# EasyEDA Pro project STM32主控板.eprj

# Schematic Schematic1
Board Name: Board1; Create Date: 2026-03-11; Page Name: P1; Project Name: STM32主控板; Schematic Name: Schematic1; Update Date: 2026-03-11; Company: 嘉立创EDA; Page Size: A4; Version: V1.0
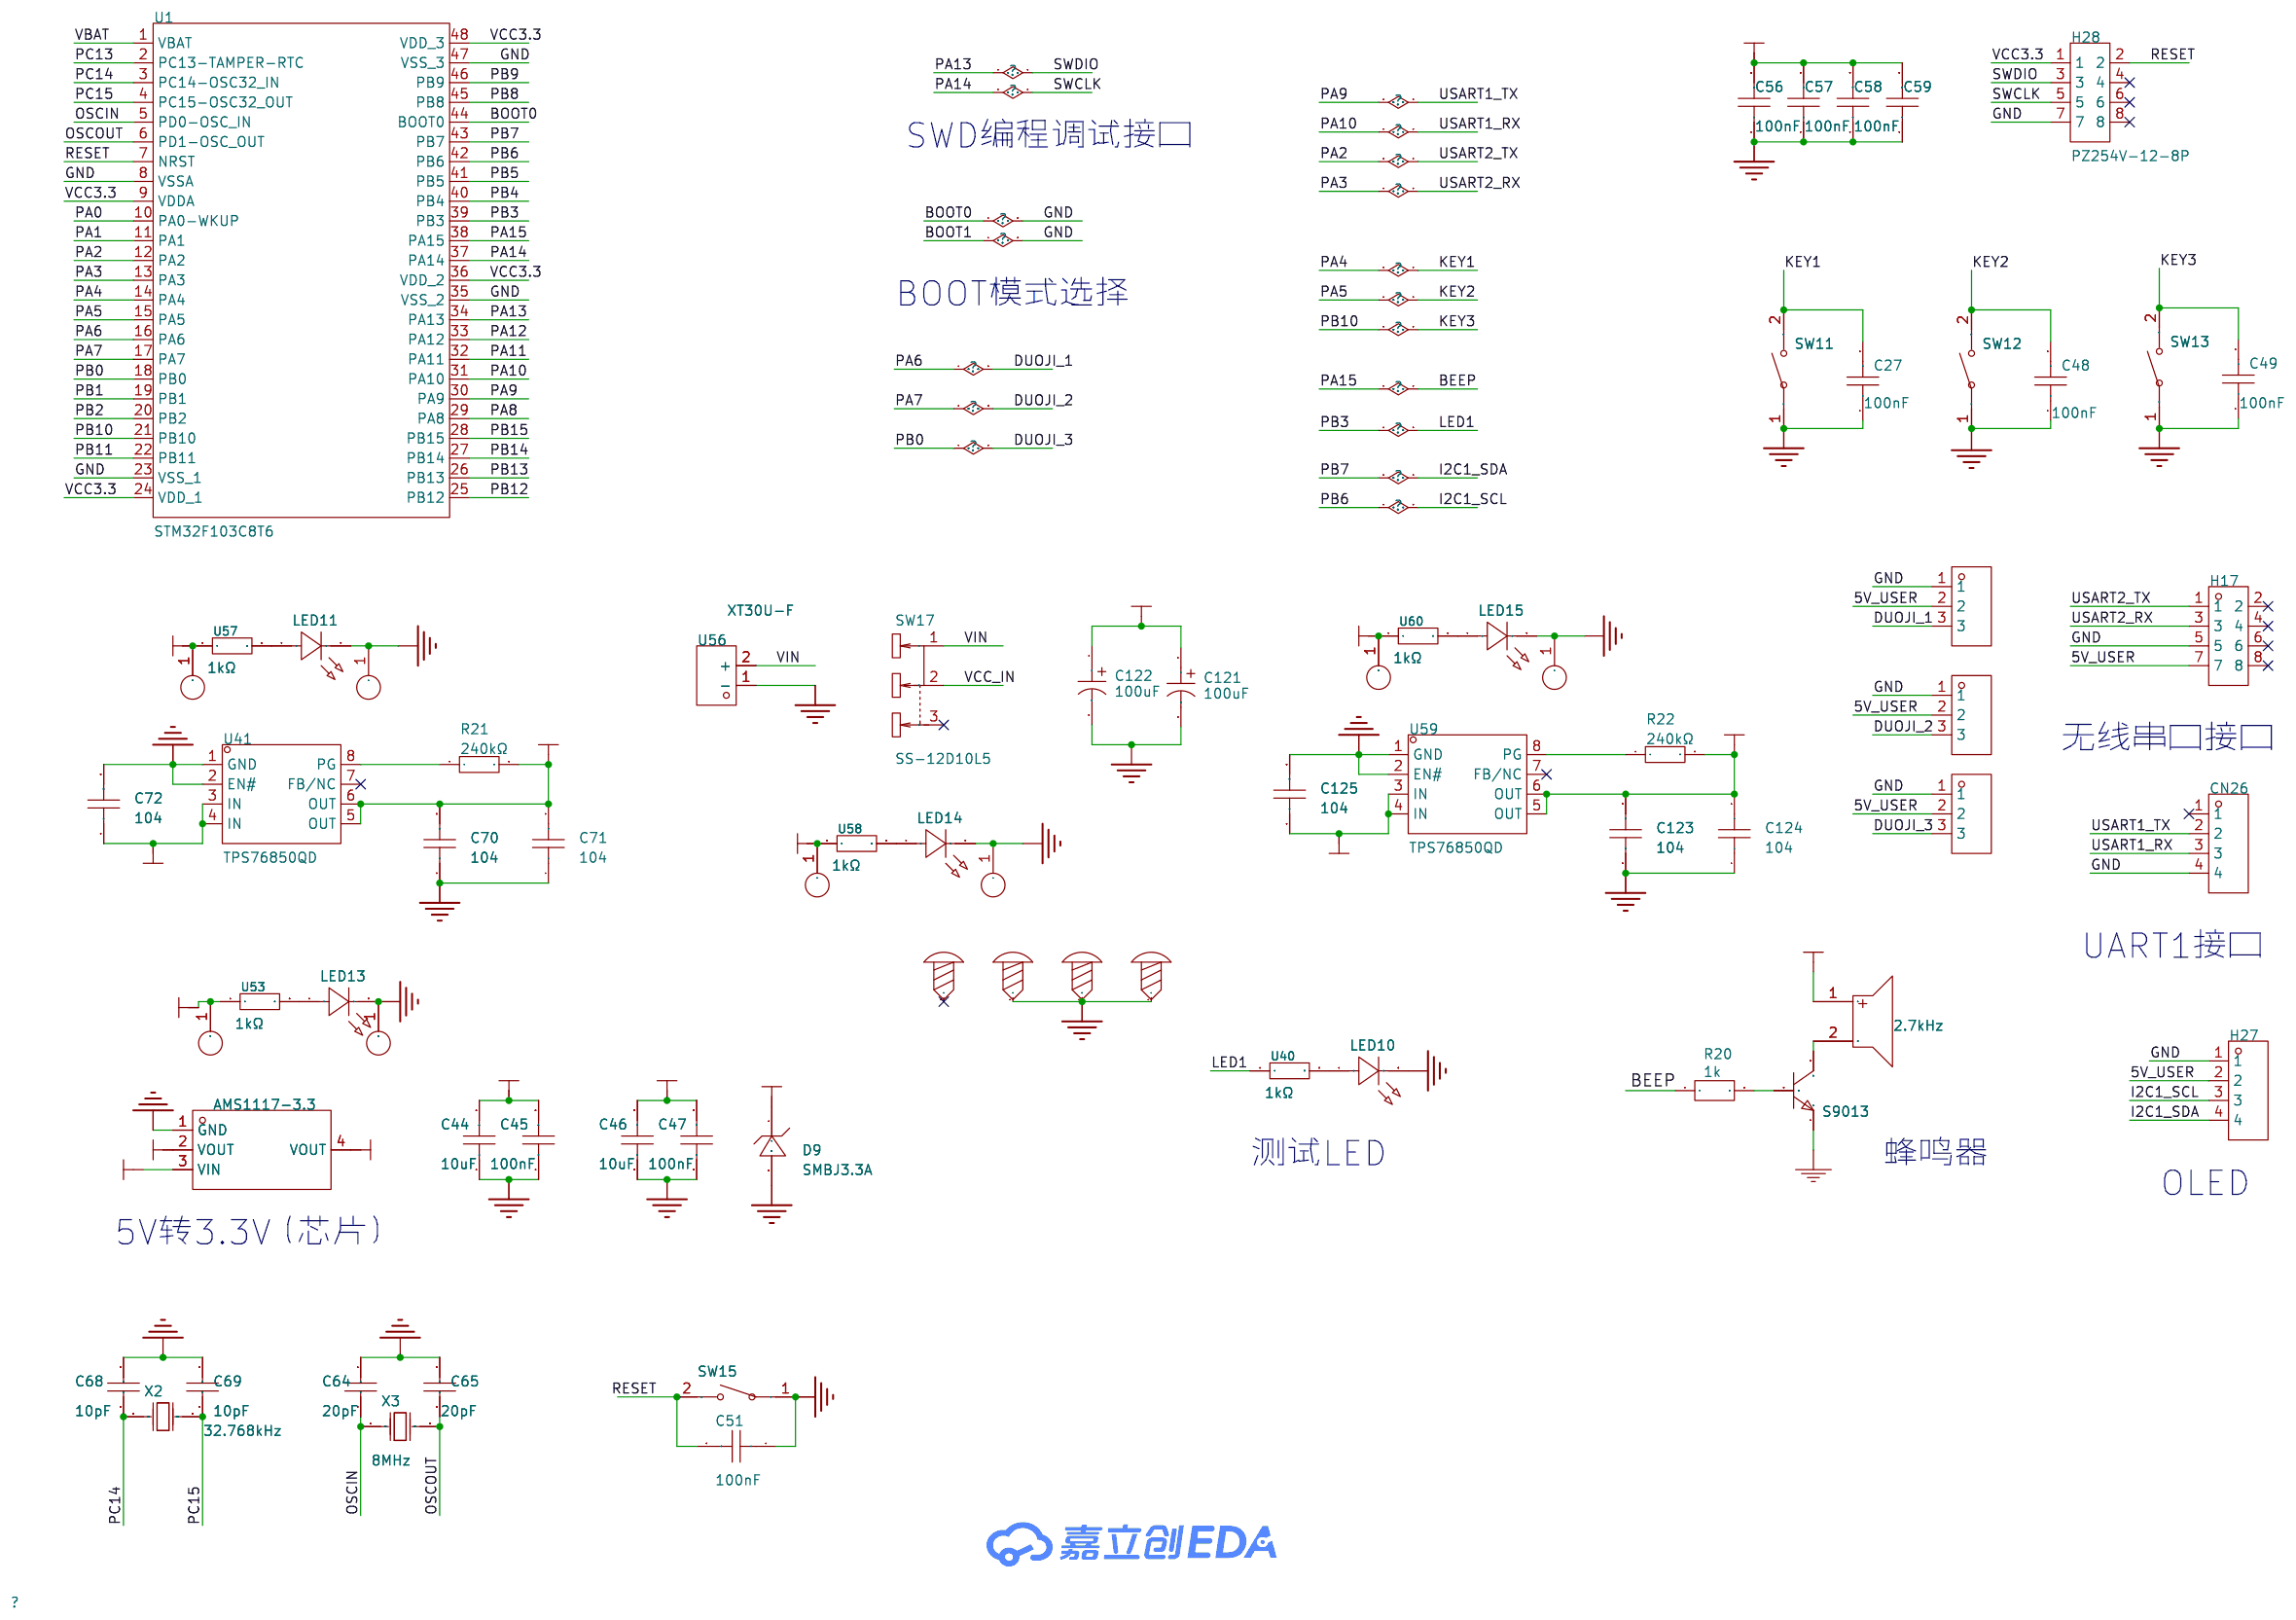
[diagram p0: schematic sheet]

## Parts
BUZZER1  2.7kHz  [BUZ-TH_BD9.0-P4.00-D0.6-FD]
C27  100nF  [C0603]
C44  10uF  [C0603]
C45  100nF  [C0603]
C46  10uF  [C0603]
C47  100nF  [C0603]
C48  100nF  [C0603]
C49  100nF  [C0603]
C51  100nF  [C0603]
C56  100nF  [C0603]
C57  100nF  [C0603]
C58  100nF  [C0603]
C59  100nF  [C0603]
C64  20pF  [C0603]
C65  20pF  [C0603]
C68  10pF  [C0603]
C69  10pF  [C0603]
C70  104  [C0603]
C71  104  [C0603]
C72  104  [C0603]
C121  100uF  [CAP-SMD_BD6.3-L6.6-W6.6-LS7.6-FD-1]
C122  100uF  [CAP-SMD_BD6.3-L6.6-W6.6-LS7.6-FD-1]
C123  104  [C0603]
C124  104  [C0603]
C125  104  [C0603]
CN15  5012  [TESTPOINT-TH_BD2.0_C9900010656]  (no BOM)
CN18  5012  [TESTPOINT-TH_BD2.0_C9900010656]  (no BOM)
CN26  ZX-XH2.54-4PZZ  [CONN-TH_4P-P2.50_4PIN]
CN28  5012  [TESTPOINT-TH_BD2.0_C9900010656]  (no BOM)
CN29  5012  [TESTPOINT-TH_BD2.0_C9900010656]  (no BOM)
CN30  5012  [TESTPOINT-TH_BD2.0_C9900010656]  (no BOM)
CN31  5012  [TESTPOINT-TH_BD2.0_C9900010656]  (no BOM)
CN49  ZX-XH2.54-3PZZ  [CONN-TH_3P-P2.54_2501S-3P]
CN50  ZX-XH2.54-3PZZ  [CONN-TH_3P-P2.54_2501S-3P]
CN52  ZX-XH2.54-3PZZ  [CONN-TH_3P-P2.54_2501S-3P]
CN53  5012  [TESTPOINT-TH_BD2.0_C9900010656]  (no BOM)
CN54  5012  [TESTPOINT-TH_BD2.0_C9900010656]  (no BOM)
D9  SMBJ3.3A  [SMB_L4.6-W3.6-LS5.3-RD]
H17  PM254V-12-08-H85  [HDR-TH_8P-P2.54-V-F-R2-C4-S2.54]
H27  PZ254V-11-04P  [HDR-TH_4P-P2.54-V-M]
H28  PZ254V-12-8P  [HDR-TH_8P-P2.54-V-M-R2-C4-S2.54]
LED10  XL-3216SURC  [LED1206-R-RD_RED]
LED11  XL-3216SURC  [LED1206-R-RD_RED]
LED13  XL-3216SURC  [LED1206-R-RD_RED]
LED14  XL-3216SURC  [LED1206-R-RD_RED]
LED15  XL-3216SURC  [LED1206-R-RD_RED]
Q1  S9013  [SOT-23-3_L2.9-W1.3-P1.90-LS2.4-TR]
R20  1k  [R0603]
R21  240kΩ  [R0603]
R22  240kΩ  [R0603]
SCREW1  -  [M3螺丝]
SCREW2  -  [M3螺丝]
SCREW3  -  [M3螺丝]
SCREW4  -  [M3螺丝]
SW11  K2-1107ST-A4DW-06  [KEY-SMD_L6.2-W3.6-LS8.0]
SW12  K2-1107ST-A4DW-06  [KEY-SMD_L6.2-W3.6-LS8.0]
SW13  K2-1107ST-A4DW-06  [KEY-SMD_L6.2-W3.6-LS8.0]
SW15  K2-1107ST-A4DW-06  [KEY-SMD_L6.2-W3.6-LS8.0]
SW17  SS-12D10L5  [SW-TH_SS-12D10L5]
U1  STM32F103C8T6  [LQFP-48_L7.0-W7.0-P0.50-LS9.0-BL]
U38  AMS1117-3.3  [SOT-223-3_L6.5-W3.4-P2.30-LS7.0-BR]
U40  1kΩ  [R0603]
U41  TPS76850QD  [SOIC-8_L4.9-W3.9-P1.27-LS6.0-BL]
U53  1kΩ  [R0603]
U56  XT30U-F  [CONN-TH_XT30U-F]
U57  1kΩ  [R0603]
U58  1kΩ  [R0603]
U59  TPS76850QD  [SOIC-8_L4.9-W3.9-P1.27-LS6.0-BL]
U60  1kΩ  [R0603]
X2  32.768kHz  [CRYSTAL-SMD_L3.2-W1.5-1]
X3  8MHz  [CRYSTAL-SMD_L5.0-W3.2]

## Library data of the parts
BUZZER1 = QMB-09B-03: 驱动方式:无源(外部驱动);构造类型:电磁式;频率:2.7kHz;声压(SPL):85dB@3V,10cm;; LCSC Part Name: 无源蜂鸣器QMB-09B-03; Supplier Part: C96256; Manufacturer: 华能; Supplier Footprint: 插件,D=9mm; JLCPCB Part Class: 扩展库; Datasheet: https://atta.szlcsc.com/upload/public/pdf/source/20210401/C96256_958B17753B5AD7CBFBCFFC7C095B4484.pdf; Supplier: LCSC; Oscillator Circuit: 无源(外部驱动); Technology Type: 电磁式; Operating Voltage: 2V~5V; Sound Pressure Level (SPL): 85dB@3V,10cm; Diameter (φD): 9mm; Height: 5.7mm
C27 C45 C47-C49 C51 C56-C59 = CC0603KRX7R9BB104: 容值:100nF;精度:±10%;额定电压:50V;材质(温度系数):X7R;; LCSC Part Name: 100nF ±10% 50V; Supplier Part: C14663; Manufacturer: YAGEO(国巨); Supplier Footprint: 0603; JLCPCB Part Class: Basic Part; Datasheet: https://atta.szlcsc.com/upload/public/pdf/source/20180910/C282072_33301C7F631E79921B82A8DAC6BCC5B3.pdf; Supplier: LCSC; Tolerance: ±10%; Voltage Rated: 50V; Temperature Coefficient: X7R
C44 C46 = CL10A106MA8NRNC: 容值:10uF;精度:±20%;额定电压:25V;材质(温度系数):X5R;; LCSC Part Name: 10uF ±20% 25V; Supplier Part: C96446; Manufacturer: SAMSUNG(三星); Supplier Footprint: 0603; JLCPCB Part Class: 基础库; Datasheet: https://atta.szlcsc.com/upload/public/pdf/source/20160218/1457707763339.pdf; Supplier: LCSC; Tolerance: ±20%; Voltage Rated: 25V; Temperature Coefficient: X5R
C64 C65 = CL10C200JB8NNNC: 容值:20pF;精度:±5%;额定电压:50V;材质(温度系数):C0G;; LCSC Part Name: 20pF ±5% 50V; Supplier Part: C1648; Manufacturer: SAMSUNG(三星); Supplier Footprint: 0603; JLCPCB Part Class: 基础库; Datasheet: https://atta.szlcsc.com/upload/public/pdf/source/20160218/1457707763339.pdf; Supplier: LCSC; Tolerance: ±5%; Voltage Rated: 50V; Temperature Coefficient: C0G
C68 C69 = CL10C100JB8NNNC: 容值:10pF;精度:±5%;额定电压:50V;材质(温度系数):C0G;; LCSC Part Name: 10pF ±5% 50V; Supplier Part: C1634; Manufacturer: SAMSUNG(三星); Supplier Footprint: 0603; JLCPCB Part Class: 基础库; Datasheet: https://atta.szlcsc.com/upload/public/pdf/source/20160218/1457707763339.pdf; Supplier: LCSC; Tolerance: ±5%; Voltage Rated: 50V; Temperature Coefficient: C0G
C70-C72 C123-C125 = CGA0603X7R104K500JT: LCSC Part Name: 100nF ±10% 50V; Supplier Part: C6119867; Manufacturer: HRE(芯声); Supplier Footprint: 0603; JLCPCB Part Class: 扩展库; Datasheet: https://item.szlcsc.com/datasheet/CGA0603X7R104K500JT/7062573.html; Supplier: LCSC; Tolerance: ±10%; Voltage Rating: 50V; Temperature Coefficient: X7R
C121 C122 = RVE100UF35V67RV0072: 容值:100uF;精度:±20%;额定电压:35V;纹波电流:230mA@120Hz;等效串联电阻:600mΩ@100kHz;; LCSC Part Name: 100uF ±20% 35V; Supplier Part: C2836437; Manufacturer: KNSCHA(科尼盛); Supplier Footprint: SMD,D6.3xL7.7mm; JLCPCB Part Class: Extended Part; Datasheet: https://atta.szlcsc.com/upload/public/pdf/source/20220719/B52EB46F8A1558448ED03D8B4CB3C24F.pdf; Supplier: LCSC; Tolerance: ±20%; Rated Voltage: 35V; Ripple Current: 230mA@120Hz; Equivalent Series Resistance(ESR): 600mΩ@100kHz; φD: 6.3mm; L: 7.7mm; Lifetime @ Temp: 2000hrs@105℃; Operating Temperature: -55℃~+105℃
CN15 CN18 CN28-CN31 CN53 CN54 = 5012: LCSC Part Name: 测试点; Supplier Part: C2906766; Manufacturer: Keystone; JLCPCB Part Class: ExtendedPart; Datasheet: https://atta.szlcsc.com/upload/public/pdf/source/20211102/12102DF701EA335825673F0350517149.pdf; Supplier: LCSC; Check: true
CN26 = ZX-XH2.54-4PZZ: 插针结构:1x4P;间距:2.54mm;安装方式:直插;参考系列:XH;总PIN数:4P;排数:1;每排PIN数:4;行距:-;额定电流:3A;触头材质:黄铜;触头镀层:锡;工作温度范围:-25℃~+85℃;; Supplier Part: C7429634; Manufacturer: Megastar(兆星); Supplier Footprint: 插件,P=2.54mm; JLCPCB Part Class: 扩展库; Datasheet: https://atta.szlcsc.com/upload/public/pdf/source/20230619/B529A2163E0159A644AB3383D208FB03.pdf; Supplier: LCSC; Pins Structure: 1x4P; Pitch: 2.54mm; Mounting Style: 直插; Reference Series: XH; Number of Pins: 4P; Number of Rows: 1; Number of PINs Per Row: 4; Current Rating (Max): 3A; Contact Material: 黄铜; Contact Plating: 锡; Operating Temperature Range: -25℃~+85℃
CN49 CN50 CN52 = ZX-XH2.54-3PZZ: LCSC Part Name: 1x3P 间距:2.5mm 直插 系列:XH; Supplier Part: C7429633; Manufacturer: Megastar(兆星); Supplier Footprint: 插件,P=2.5mm; JLCPCB Part Class: 扩展库; Datasheet: https://item.szlcsc.com/datasheet/ZX-XH2.54-3PZZ/8427550.html; Supplier: LCSC; Pins Structure: 1x3P; Pitch: 2.5mm; Mounting Type: 直插; Reference Series: XH; Number of Pins: 3P; Number of Rows: 1; Number of PINs Per Row: 3; Current Rating: 3A; Contact Material: 黄铜; Contact Plating: 锡; Operating Temperature: -25℃~+85℃; Voltage Rating: 250V; Plastic Material: PA66; Flame Retardant Rating: UL94V-0; Color: 白色; Z-Height of the Board: 7mm; X-Length of Bottom Edge on Board (Spacing Line): 10mm; Y-Width of Bottom Edge on Board: 5.9mm; Mounting Style: 直插; Current Rating (Max): 3A; Operating Temperature Range: -25℃~+85℃
D9 = SMBJ3.3A_C362089: 反向截止电压(Vrwm):3.3V;最大钳位电压:7.3V;峰值脉冲功率(Ppp)@10/1000us:600W;击穿电压:4.1V;; LCSC Part Name: 单向TVS 3.3V截止 600W峰值脉冲功率; Supplier Part: C362089; Manufacturer: JKSEMI(金开盛); Supplier Footprint: SMB(DO-214AA); JLCPCB Part Class: 扩展库; Datasheet: https://atta.szlcsc.com/upload/public/pdf/source/20200731/C362089_3B984BF84356FE4A5051ADB3F5B1E766.pdf; Supplier: LCSC; Reverse Stand-Off Voltage (Vrwm): 3.3V; Maximum Clamping Voltage: 7.3V; Peak Pulse Power Dissipation (Ppp)@10/1000us: 600W; Breakdown Voltage: 4.1V; Type: TVS
H17 = PM254V-12-08-H85: 插孔结构:2x4P;间距:2.54mm;行距:2.54mm;圆孔/方孔:方孔;安装类型:直插;排数:双排;总孔位数:8P;额定电流:3A;额定电压:250V;插孔方向:顶部;塑高:8.5mm;工作温度范围:-40℃~+105℃;; LCSC Part Name: 间距:2.54mm 2x4P 直插; Supplier Part: C2834799; Manufacturer: XFCN(兴飞); Supplier Footprint: 插件,P=2.54mm; JLCPCB Part Class: 扩展库; Datasheet: https://atta.szlcsc.com/upload/public/pdf/source/20200309/C492399_8C441E2934FBB604A89B37A68AA45ECF.pdf; Supplier: LCSC; Holes Structure: 2x4P; Pitch: 2.54mm; Row Spacing: 2.54mm; Circular Hole / Square Hole: 方孔; Mounting Type: 直插; Number of Rows: 双排; Number of Holes: 8P; Current Rating (Max): 3A; Voltage Rating (Max): 250V; Holes Direction: 顶部; Insulation Height: 8.5mm; Operating Temperature Range: -40℃~+105℃
H27 = PZ254V-11-04P: 插针结构:1x4P;间距:2.54mm;行距:-;圆针/方针:方针;安装类型:直插;排数:单排;总PIN位数:4P;额定电流:3A;额定电压:250V;配合针长度:6mm;塑高:2.5mm;端接针长度:3mm;触头材质:-;工作温度范围:-40℃~+105℃;颜色:黑色;; LCSC Part Name: 间距:2.54mm 1x4P 直插 方针; Supplier Part: C2691448; Manufacturer: XFCN(兴飞); Supplier Footprint: 插件,P=2.54mm; JLCPCB Part Class: 扩展库; Datasheet: https://atta.szlcsc.com/upload/public/pdf/source/20200309/C492403_F9F19131791D08044AD4F84F8E751A34.pdf; Supplier: LCSC; Pin Structure: 1x4P; Pitch: 2.54mm; Circluar Pins/Square Pins: 方针; Mounting Type: 直插; Number of Rows: 单排; Number of Pins: 4P; Current Rating (Max): 3A; Voltage Rating (Max): 250V; Length of Mating Pin: 6mm; Insulation Height: 2.5mm; Length of End Connection Pin: 3mm; Operating Temperature Range: -40℃~+105℃; Color: 黑色
H28 = PZ254V-12-8P: LCSC Part Name: 2x4P 间距:2.54mm 方针 直插; Supplier Part: C492421; Manufacturer: XFCN(兴飞); Supplier Footprint: 插件,P=2.54mm; JLCPCB Part Class: 扩展库; Datasheet: https://item.szlcsc.com/datasheet/PZ254V-12-8P/502977.html; Supplier: LCSC; Pin Structure: 2x4P; Pitch: 2.54mm; Row Spacing: 2.54mm; Circluar Pins/Square Pins: 方针; Mounting Type: 直插; Number of Rows: 双排; Number of Pins: 8P; Length of Mating Pin: 6mm; Insulation Height: 2.5mm; Length of End Connection Pin: 3mm; Contact Material: 黄铜; Operating Temperature: -40℃~+105℃; Color: 黑色
LED10 LED11 LED13-LED15 = XL-3216SURC: 发光颜色:红色;功率:55mW;正向电流:25mA;主波长:617nm~621nm;透镜颜色:无色透明透镜;色温:-;发光角度:120°;载带方式:正贴;工作温度:-30℃~+85℃;; Supplier Part: C965822; Manufacturer: XINGLIGHT(成兴光); Supplier Footprint: 1206; JLCPCB Part Class: 扩展库; Datasheet: https://atta.szlcsc.com/upload/public/pdf/source/20221102/38B682A5E5FDBBFCA7077B6272CE8E6F.pdf; Supplier: LCSC; Emitted Color: 红色; Power Dissipation: 55mW; Forward Current: 25mA; Dominant Wavelength: 617nm~621nm; Peak Wavelength: 623nm; Lens Color: 无色透明透镜; Viewing Angle: 120°; Mounting Sytle: 正贴; Operating Temperature: -30℃~+85℃
Q1 = S9013: link: https://item.szlcsc.com/70837.html; 3DModel: SOT-23-3P_L2.9-W1.3-H1.0-LS2.4-P0.95; Supplier: LCSC; Manufacturer: KEC; Manufacturer Part: 2n3904S-RTK/PS; Supplier Part: C18536; Paste Type: SOT-23
R20 = 1k: link: https://www.mouser.in/datasheet/2/447/PYu_RT_1_to_0_01_RoHS_L_11-1669912.pdf
R21 R22 = 0603WAF1001T5E: LCSC Part Name: 1kΩ ±1% 100mW 厚膜电阻; Supplier Part: C21190; Manufacturer: UNI-ROYAL(厚声); Supplier Footprint: 0603; JLCPCB Part Class: 基础库; Datasheet: https://item.szlcsc.com/datasheet/0603WAF1001T5E/21904.html; Supplier: LCSC; Type: 厚膜电阻; Tolerance: ±1%; Power(Watts): 100mW; Voltage-Supply(Max): 75V; Temperature Coefficient: ±100ppm/℃; Operating Temperature: -55℃~+155℃
SCREW1-SCREW4 = M3螺丝: Supplier Footprint: 插件
SW11-SW13 SW15 = K2-1107ST-A4DW-06: 电路结构:单刀单掷;按钮形状:矩形按钮;作用力:250gf;安装方式:立贴;开关长度:6.1mm;开关宽度:3.6mm;开关高度:2.5mm;触点电流:50mA;额定电压(DC):12V;绝缘电阻:100MΩ;带灯:-;机械寿命:10万次;; LCSC Part Name: 轻触开关 3.6*6.1*2.5; Supplier Part: C118141; Manufacturer: 韩国韩荣; Supplier Footprint: SMD; JLCPCB Part Class: 扩展库; Datasheet: https://atta.szlcsc.com/upload/public/pdf/source/20210810/381712CEF248770C072B585C3485C888.pdf; Supplier: LCSC; Circuit: 单刀单掷; Actuator Style: 矩形按钮; Operating Force: 250gf; Mounting Style: 立贴; Switch Length: 6.1mm; Switch Width: 3.6mm; Switch Height: 2.5mm; Contact Current: 50mA; Voltage Rating (DC): 12V; Insulation Resistance: 100MΩ; Mechanical Life: 10万次; Operating Temperature: -25℃~+85℃
SW17 = SS-12D10L5: 电路结构:单刀双掷;安装方式:直插;开关颜色:黑色;额定电流(DC):3A;额定电压(DC):125V;额定电流(AC):3A;额定电压(AC):125V;机械寿命:1万次;; LCSC Part Name: 柄长5mm 直插双档 滑动开关; Supplier Part: C319012; Manufacturer: XKB Connectivity(中国星坤); Supplier Footprint: 插件; JLCPCB Part Class: 扩展库; Datasheet: https://atta.szlcsc.com/upload/public/pdf/source/20211009/D6412F37AABE6F9459A6EE7FA4DAEADB.pdf; Supplier: LCSC; Circuit: 单刀双掷; Actuator Style: 矩形柱状; Pin Style: PC引脚; Switch Length: 13mm; Switch Width: 6.8mm; Switch Height: 6.4mm; Mounting Style: 直插; Actuator Color: 黑色; Current Rating (DC): 3A; Voltage Rating (DC): 125V; Current Rating (AC): 3A; Voltage Rating (AC): 125V; Mechanical Life: 1万次; Operating Temperature: -40℃~+85℃
U1 = STM32F103C8T6: LCSC Part Name: 主流增强型ARM Cortex-M3 MCU，具有64 KB Flash、72 MHz CPU、电机控制、USB和CAN; Supplier Part: C8734; Manufacturer: ST(意法半导体); Supplier Footprint: LQFP-48(7x7); JLCPCB Part Class: 扩展库; Datasheet: https://item.szlcsc.com/datasheet/STM32F103C8T6/9243.html; Supplier: LCSC; CPU Core: ARM-M3; CPU Maximum Speed: 72MHz; Program Storage Size: 64KB; Program Memory Type: FLASH; Number of I/O: 37; ADC (Bit): 12bit; Voltage - Supply: 2V~3.6V
U38 = AMS1117-3.3_C6186: 输出类型:固定;最大输入电压:-;输出电压:3.3V;最大输出电流:1A;电源纹波抑制比(PSRR):72dB@(120Hz);输出极性:正极;; LCSC Part Name: 输出3.3V 1A; Supplier Part: C6186; Manufacturer: AMS; Supplier Footprint: SOT-223; JLCPCB Part Class: 基础库; Datasheet: https://atta.szlcsc.com/upload/public/pdf/source/20180727/C6186_7A095716F0823C02F1997A905E26C086.pdf; Supplier: LCSC; Output Type: 固定; Output Voltage: 3.3V; MAX Output Current: 1A; Power Supply Rejection Ratio (PSRR): 72dB@(120Hz); Dropout Voltage: 1.3V@(800mA); Output Polarity: 正极; Number of Outputs: 1
U40 U53 U57 U58 U60 = RT0603BRD071K01L: 电阻类型:薄膜电阻;阻值:1.01kΩ;精度:±0.1%;功率:100mW;温度系数:±25ppm/℃;; LCSC Part Name: 薄膜电阻 1.01kΩ ±0.1% 100mW; Supplier Part: C861188; Manufacturer: YAGEO(国巨); Supplier Footprint: 0603; JLCPCB Part Class: 扩展库; Datasheet: https://atta.szlcsc.com/upload/public/pdf/source/20200610/C326738_5639A9F1B6EB6E4AE2197577D3456E7F.pdf; Supplier: LCSC; Type: 薄膜电阻; Tolerance: ±0.1%; Power(Watts): 100mW; Temperature Coefficient: ±25ppm/℃; Operating Temperature Range: -55℃~+155℃
U41 U59 = TPS76850QD: LCSC Part Name: 5V 1A 10V; Supplier Part: C194763; Manufacturer: TI(德州仪器); Supplier Footprint: SOIC-8; JLCPCB Part Class: 扩展库; Datasheet: https://www.ti.com/cn/lit/gpn/tps768; Supplier: LCSC; Output Type: 固定; Voltage - Supply: 10V; Output Voltage: 5V; Output Current: 1A; Power Supply Rejection Ratio (PSRR): 60dB@(1kHz); Voltage Dropout: 380mV@(1A); standby current: 85uA; Features: PG脚；过热保护; Operating Temperature: -40℃~+125℃; Output Configuration: 正极; Number of Outputs: 1
U56 = XT30U-F: 类别:-;类型1:-;; LCSC Part Name: AMASS(艾迈斯)轻量版锂电池插头母头 XT30U-F; Supplier Part: C99102; Manufacturer: AMASS(艾迈斯); JLCPCB Part Class: 扩展库; Datasheet: https://atta.szlcsc.com/upload/public/pdf/source/20190916/C428721_B0ECB8C5937139CEFE8736D2D3175B0E.pdf; Supplier: LCSC; Brand: 艾迈斯; Type: 插头; Colour: 黄色; InterfaceType: 母头
X2 = XKXGI-SUA-32.768K: 晶振类型:贴片晶振;频率:32.768kHz;常温频差:±20ppm;外接负载电容:12.5pF;频率稳定度(全温):±30ppm;; LCSC Part Name: 32.768kHz ±20ppm 12.5pF YST310S; Supplier Part: C5213671; Manufacturer: YXC(扬兴晶振); Supplier Footprint: SMD3215-2P; JLCPCB Part Class: 扩展库; Datasheet: https://atta.szlcsc.com/upload/public/pdf/source/20240329/3A7650FD985DD0DE85694D3785AB4916.pdf; Supplier: LCSC; Crystal Type: 贴片晶振; Normal temperature Frequency Tolerance: ±20ppm; External load capacitor: 12.5pF; Frequency Stability(Full temperature range): ±30ppm; Operating Temperature: -40℃~+85℃
X3 = X50328MSB2GI: 晶振类型:贴片晶振;频率:8MHz;常温频差:±10ppm;负载电容:20pF;频率稳定度:±20ppm;; LCSC Part Name: YSX530GA 8MHZ 2P 5032 20PF ±10PPM -40~85℃ (±20PPM); Supplier Part: C115962; Manufacturer: YXC(扬兴晶振); Supplier Footprint: SMD5032; JLCPCB Part Class: 基础库; Datasheet: https://atta.szlcsc.com/upload/public/pdf/source/20240329/44922B0AF7B60E58E9B66993B6077277.pdf; Supplier: LCSC; Type: 贴片晶振; Normal temperature Frequency Tolerance: ±10ppm; Load Capacitance: 20pF; Frequency Stability: ±20ppm; Operating Temperature: -40℃~+85℃

## Nets
5V_CORE: C44.2 C45.2 C70.2 C71.2 CN15.1 R21.2 U38.3(VIN) U41.5(OUT) U41.6(OUT) U57.1
5V_USER: BUZZER1.1 C123.2 C124.2 CN49.2 CN50.2 CN52.2 CN53.1 H17.7 H27.2 R22.2 U59.5(OUT) U59.6(OUT) U60.1
GND: C27.1 C44.1 C45.1 C46.1 C47.1 C48.1 C49.1 C51.1 C56.1 C57.1 C58.1 C59.1 C64.2 C65.2 C68.2 C69.2 C70.1 C71.1 C72.2 C121.2 C122.2 C123.1 C124.1 C125.2 CN18.1 CN26.4 CN28.1 CN31.1 CN49.1 CN50.1 CN52.1 CN54.1 D9.2 H17.5 H27.1 H28.7 LED10.2(A) LED11.2(A) LED13.2(A) LED14.2(A) LED15.2(A) Q1.1(E) SCREW2.1 SCREW3.1 SCREW4.1 SW11.1 SW12.1 SW13.1 SW15.1 U1.8(VSSA) U1.23(VSS_1) U1.35(VSS_2) U1.44(BOOT0) U1.47(VSS_3) U38.1(GND) U41.1(GND) U41.2(EN#) U56.1(-) U59.1(GND) U59.2(EN#)
VBAT: U1.1(VBAT)
VCC3.3: C46.2 C47.2 C56.2 C57.2 C58.2 C59.2 CN29.1 D9.1 H28.1 U1.9(VDDA) U1.24(VDD_1) U1.36(VDD_2) U1.48(VDD_3) U38.2(VOUT) U38.4(VOUT) U53.1
VCC_IN: C72.1 C121.1 C122.1 C125.1 CN30.1 SW17.2 U41.3(IN) U41.4(IN) U58.1 U59.3(IN) U59.4(IN)
VIN: SW17.1 U56.2(+)
BEEP: R20.1 U1.38(PA15)
DUOJI_1: CN49.3 U1.16(PA6)
DUOJI_2: CN52.3 U1.17(PA7)
DUOJI_3: CN50.3 U1.18(PB0)
I2C1_SCL: H27.3 U1.42(PB6)
I2C1_SDA: H27.4 U1.43(PB7)
KEY1: C27.2 SW11.2 U1.14(PA4)
KEY2: C48.2 SW12.2 U1.15(PA5)
KEY3: C49.2 SW13.2 U1.21(PB10)
LED1: U1.39(PB3) U40.1
OSCIN: C64.1 U1.5(PD0-OSC_IN) X3.1(OSC1)
OSCOUT: C65.1 U1.6(PD1-OSC_OUT) X3.2(OSC2)
PA0: U1.10(PA0-WKUP)
PA1: U1.11(PA1)
PA2: H17.1 U1.12(PA2)
PA3: H17.3 U1.13(PA3)
PA8: U1.29(PA8)
PA9: CN26.2 U1.30(PA9)
PA10: CN26.3 U1.31(PA10)
PA11: U1.32(PA11)
PA12: U1.33(PA12)
PA13: H28.3 U1.34(PA13)
PA14: H28.5 U1.37(PA14)
PB1: U1.19(PB1)
PB2: U1.20(PB2)
PB4: U1.40(PB4)
PB5: U1.41(PB5)
PB8: U1.45(PB8)
PB9: U1.46(PB9)
PB11: U1.22(PB11)
PB12: U1.25(PB12)
PB13: U1.26(PB13)
PB14: U1.27(PB14)
PB15: U1.28(PB15)
PC13: U1.2(PC13-TAMPER-RTC)
PC14: C68.1 U1.3(PC14-OSC32_IN) X2.1(OSC1)
PC15: C69.1 U1.4(PC15-OSC32_OUT) X2.2(OSC2)
RESET: C51.2 H28.2 SW15.2 U1.7(NRST)
$1N1503: LED10.1(K) U40.2
$1N1618: BUZZER1.2 Q1.3(C)
$1N1623: Q1.2(B) R20.2
$1N2481: R21.1 U41.8(PG)
$1N3606: LED13.1(K) U53.2
$1N4411: LED11.1(K) U57.2
$1N4573: LED14.1(K) U58.2
$1N5391: R22.1 U59.8(PG)
$1N5413: LED15.1(K) U60.2

Not connected (* = marked no-connect by the designer): CN26 1*; H17 2* 4* 6* 8*; H28 4* 6* 8*; SCREW1 1*; SW17 3*; U41 7(FB/NC)*; U59 7(FB/NC)*

## Notes on the sheet
- SWD编程调试接口
- BOOT模式选择
- 无线串口接口
- UART1接口
- 测试LED
- 蜂鸣器
- OLED
- 5V转3.3V（芯片）

# Board PCB1
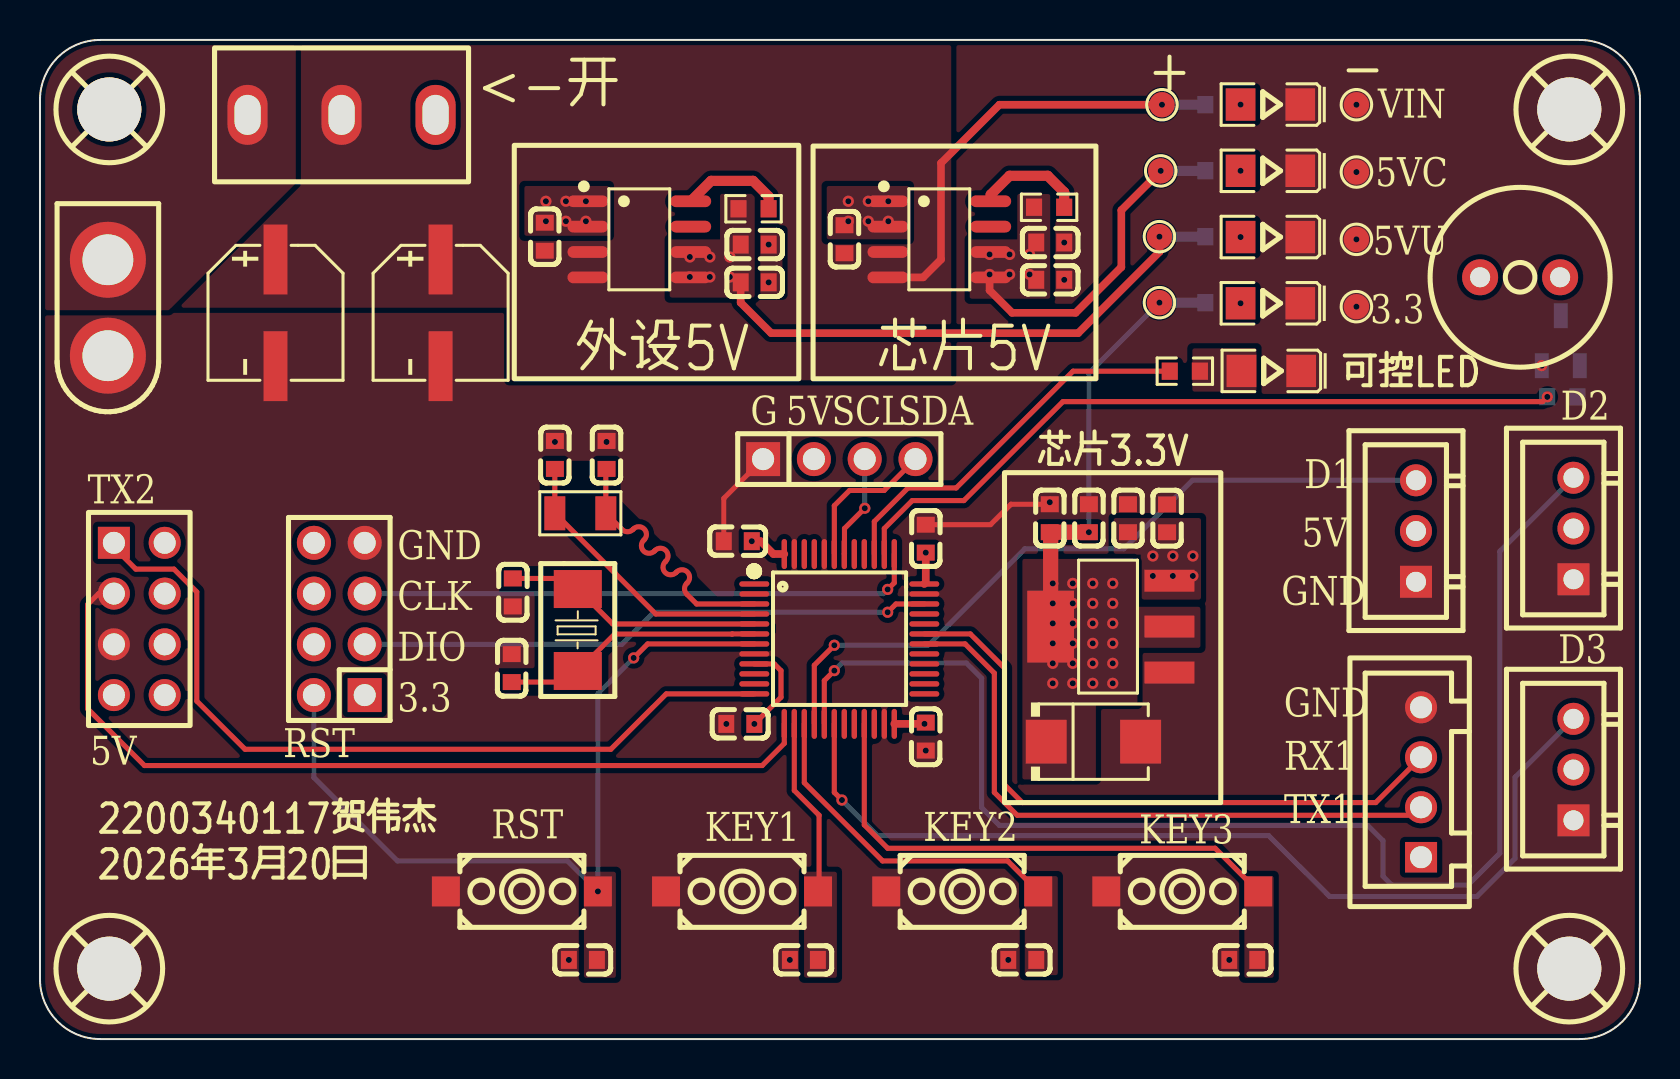
[diagram p1: board, top side]
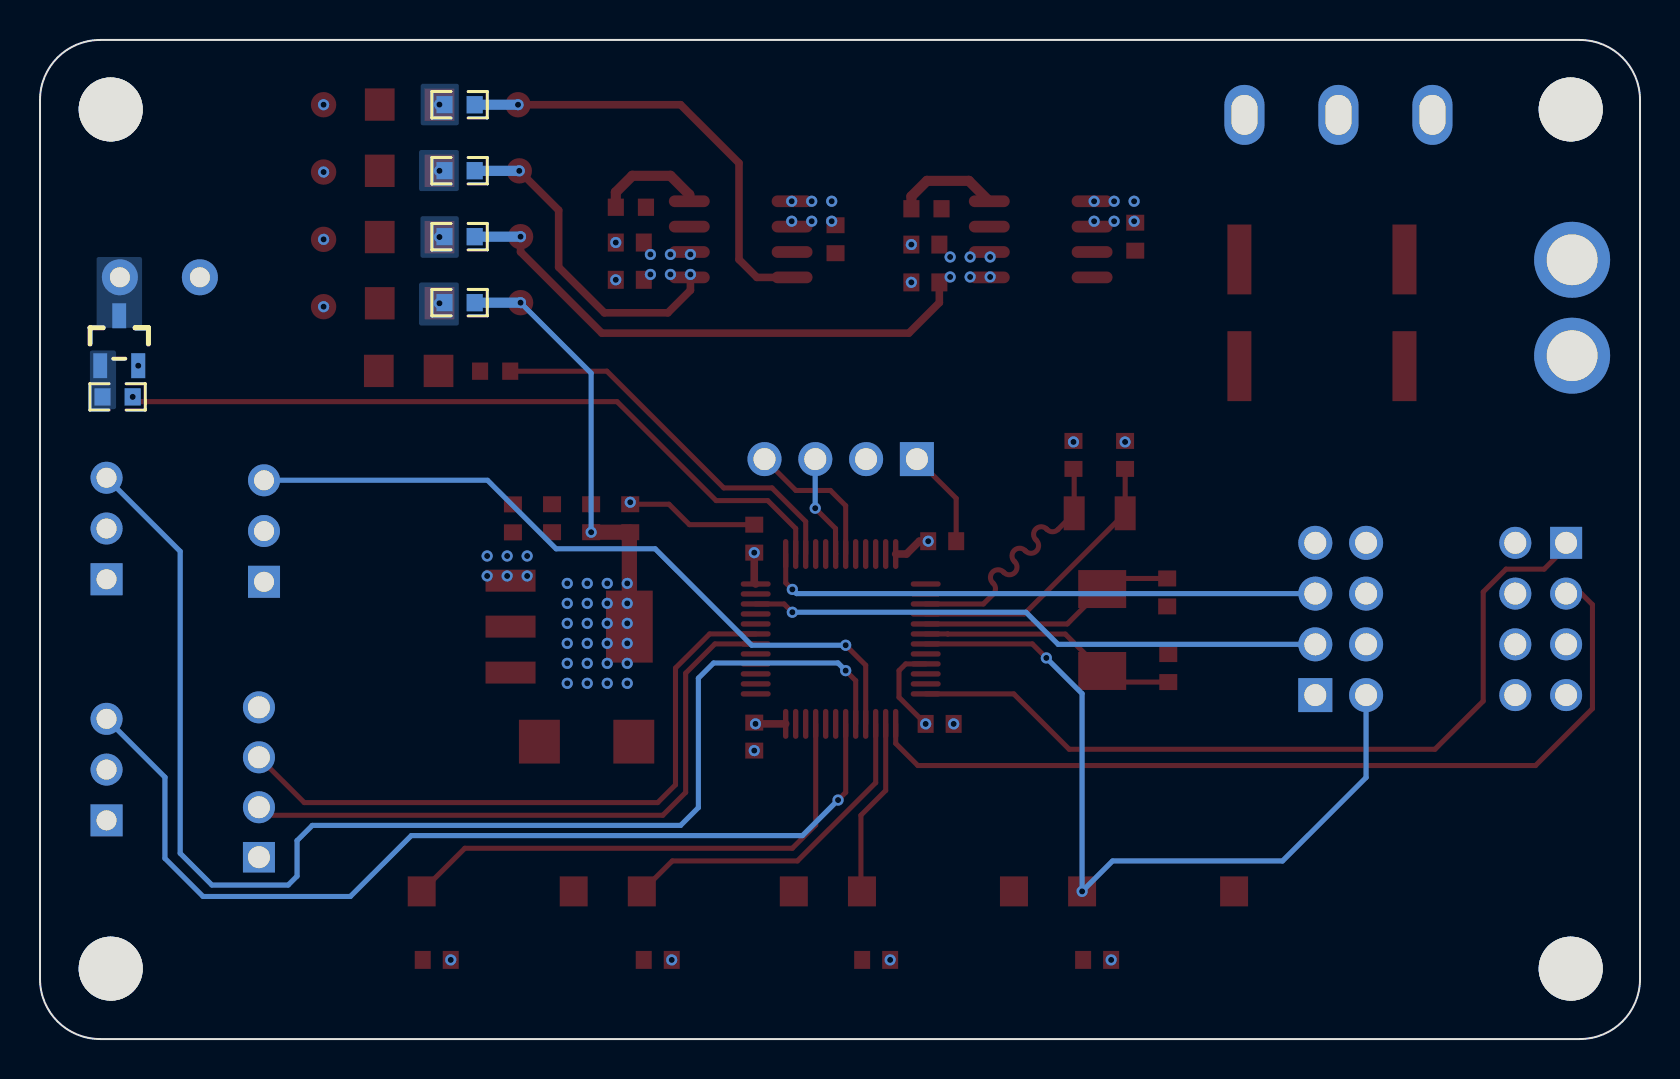
[diagram p2: board, bottom side, seen from below]

Outline 80 x 50 mm; copper layers: Top Layer, VCC, GND, Bottom Layer. Coordinates in mm from the lower left corner of the outline.
Outline path: 0,47 0,3 arc(0.88,0.88) 3,0 77,0 arc(79.12,0.88) 80,3 80,47 arc(79.12,49.12) 77,50 3,50 arc(0.88,49.12) 0,47
Stack: Top Layer 0.035mm 外层铜厚1oz / Dielectric1 0.2104mm 7628 RC49% 8.6mil / VCC 0.0152mm 内层铜厚 / Dielectric2 1.065mm 1.1mm H/HOZ Copper / GND 0.0152mm 内层铜厚 / Dielectric3 0.2104mm 7628 RC49% 8.6mil / Bottom Layer 0.035mm 外层铜厚1oz

## Design rules (mm)
net OSCIN: DP1
net OSCOUT: DP1
net PC14: DP2
net PC15: DP2
template: 自定义配置
spacing copperThickness1oz (default): track to track 0.152, other pairs 0.152 to 0.175
spacing copperThickness2oz: track to track 0.203, other pairs 0.152 to 0.3
track width copperThickness1oz (default): min 0.127, default 0.254, max 2.54
track width copperThickness2oz: min 0.203, default 0.254, max 2.54
differential pair differentialPair (default): width min 0.127, default 0.254, max 2.54; gap min 0.152, default 0.152
via viaSize (default): diameter min 0.5, default 0.559, max 10; hole min 0.3, default 0.305, max 6.299

## Placement (name value [footprint] x y rotation side)
BUZZER1  2.7kHz  [BUZ-TH_BD9.0-P4.00-D0.6-FD]  74.01 38.12 0 top
C27  100nF  [C0603]  38.19 3.96 0 top
C44  10uF  [C0603]  54.4 26.06 270 top
C45  100nF  [C0603]  56.35 26.06 270 top
C46  10uF  [C0603]  52.44 26.06 270 top
C47  100nF  [C0603]  50.49 26.06 270 top
C48  100nF  [C0603]  49.11 3.96 0 top
C49  100nF  [C0603]  60.16 3.96 0 top
C51  100nF  [C0603]  27.14 3.96 0 top
C56  100nF  [C0603]  44.29 25.04 270 top
C57  100nF  [C0603]  44.29 15.14 90 top
C58  100nF  [C0603]  35.02 15.77 0 top
C59  100nF  [C0603]  34.89 24.91 0 top
C64  20pF  [C0603]  23.64 22.35 270 top
C65  20pF  [C0603]  23.59 18.56 90 top
C68  10pF  [C0603]  28.33 29.23 90 top
C69  10pF  [C0603]  25.75 29.23 90 top
C70  104  [C0603]  50.51 38 180 top
C71  104  [C0603]  50.51 39.86 180 top
C72  104  [C0603]  40.22 40.03 90 top
C121  100uF  [CAP-SMD_BD6.3-L6.6-W6.6-LS7.6-FD-1]  20.03 36.34 270 top
C122  100uF  [CAP-SMD_BD6.3-L6.6-W6.6-LS7.6-FD-1]  11.78 36.34 270 top
C123  104  [C0603]  35.73 37.87 180 top
C124  104  [C0603]  35.73 39.76 180 top
C125  104  [C0603]  25.24 40.15 90 top
CN15  5012  [TESTPOINT-TH_BD2.0_C9900010656]  56.04 43.45 0 top
CN18  5012  [TESTPOINT-TH_BD2.0_C9900010656]  65.82 36.65 0 top
CN26  ZX-XH2.54-4PZZ  [CONN-TH_4P-P2.50_4PIN]  69.05 12.85 90 top
CN28  5012  [TESTPOINT-TH_BD2.0_C9900010656]  65.82 43.39 0 top
CN29  5012  [TESTPOINT-TH_BD2.0_C9900010656]  55.97 36.85 0 top
CN30  5012  [TESTPOINT-TH_BD2.0_C9900010656]  56.1 46.76 0 top
CN31  5012  [TESTPOINT-TH_BD2.0_C9900010656]  65.82 46.76 0 top
CN49  ZX-XH2.54-3PZZ  [CONN-TH_3P-P2.54_2501S-3P]  68.8 25.42 90 top
CN50  ZX-XH2.54-3PZZ  [CONN-TH_3P-P2.54_2501S-3P]  76.67 13.48 90 top
CN52  ZX-XH2.54-3PZZ  [CONN-TH_3P-P2.54_2501S-3P]  76.67 25.55 90 top
CN53  5012  [TESTPOINT-TH_BD2.0_C9900010656]  55.97 40.15 0 top
CN54  5012  [TESTPOINT-TH_BD2.0_C9900010656]  65.82 40.02 0 top
D9  SMBJ3.3A  [SMB_L4.6-W3.6-LS5.3-RD]  52.67 14.88 0 top
H17  PM254V-12-08-H85  [HDR-TH_8P-P2.54-V-F-R2-C4-S2.54]  4.97 21.02 270 top
H27  PZ254V-11-04P  [HDR-TH_4P-P2.54-V-M]  39.97 29.02 0 top
H28  PZ254V-12-8P  [HDR-TH_8P-P2.54-V-M-R2-C4-S2.54]  14.97 21.02 90 top
LED10  XL-3216SURC  [LED1206-R-RD_RED]  61.57 33.44 180 top
LED11  XL-3216SURC  [LED1206-R-RD_RED]  61.52 43.45 180 top
LED13  XL-3216SURC  [LED1206-R-RD_RED]  61.52 36.82 180 top
LED14  XL-3216SURC  [LED1206-R-RD_RED]  61.52 46.77 180 top
LED15  XL-3216SURC  [LED1206-R-RD_RED]  61.52 40.14 180 top
Q1  S9013  [SOT-23-3_L2.9-W1.3-P1.90-LS2.4-TR]  76.04 34.95 270 bottom
R20  1k  [R0603]  76.12 32.14 0 bottom
R21  240kΩ  [R0603]  50.46 41.63 180 top
R22  240kΩ  [R0603]  35.68 41.55 180 top
SCREW1  -  [M3螺丝]  3.47 46.52 0 top
SCREW2  -  [M3螺丝]  3.47 3.52 0 top
SCREW3  -  [M3螺丝]  76.47 3.52 0 top
SCREW4  -  [M3螺丝]  76.47 46.52 0 top
SW11  K2-1107ST-A4DW-06  [KEY-SMD_L6.2-W3.6-LS8.0]  35.1 7.39 0 top
SW12  K2-1107ST-A4DW-06  [KEY-SMD_L6.2-W3.6-LS8.0]  46.11 7.39 0 top
SW13  K2-1107ST-A4DW-06  [KEY-SMD_L6.2-W3.6-LS8.0]  57.12 7.39 0 top
SW15  K2-1107ST-A4DW-06  [KEY-SMD_L6.2-W3.6-LS8.0]  24.1 7.39 0 top
SW17  SS-12D10L5  [SW-TH_SS-12D10L5]  15.08 46.25 0 top
U1  STM32F103C8T6  [LQFP-48_L7.0-W7.0-P0.50-LS9.0-BL]  39.97 20.02 270 top
U38  AMS1117-3.3  [SOT-223-3_L6.5-W3.4-P2.30-LS7.0-BR]  53.5 20.64 0 top
U40  1kΩ  [R0603]  57.24 33.42 0 top
U41  TPS76850QD  [SOIC-8_L4.9-W3.9-P1.27-LS6.0-BL]  44.97 40.02 270 top
U53  1kΩ  [R0603]  59.02 36.85 0 bottom
U56  XT30U-F  [CONN-TH_XT30U-F]  3.39 36.6 270 top
U57  1kΩ  [R0603]  59.02 43.46 0 bottom
U58  1kΩ  [R0603]  59.02 46.76 0 bottom
U59  TPS76850QD  [SOIC-8_L4.9-W3.9-P1.27-LS6.0-BL]  29.97 40.02 270 top
U60  1kΩ  [R0603]  59.02 40.15 0 bottom
X2  32.768kHz  [CRYSTAL-SMD_L3.2-W1.5-1]  27.02 26.31 180 top
X3  8MHz  [CRYSTAL-SMD_L5.0-W3.2]  26.89 20.47 270 top

## Footprints (pads in the part's own frame, mm; a bottom-side part is the same pattern mirrored in y, then rotated)
BUZ-TH_BD9.0-P4.00-D0.6-FD
  round 1.8 hole 1: 1(-2,0) 2(2,0)
C0603
  rect 0.8x0.9 smd: 1(-0.7,0) 2(0.7,0)
CAP-SMD_BD6.3-L6.6-W6.6-LS7.6-FD-1
  rect 3.5x1.2 smd: 1(-2.67,0) 2(2.67,0)
CONN-TH_3P-P2.54_2501S-3P
  rect 1.6x1.6 hole 1: 1(-2.54,0)
  round 1.6 hole 1: 2(0,0) 3(2.54,0)
CONN-TH_4P-P2.50_4PIN
  rect 1.524x1.6 hole 1.1: 1(-3.75,0)
  round 1.6 hole 1.1: 2(-1.25,0) 3(1.25,0) 4(3.75,0)
CONN-TH_XT30U-F
  round 3.8 hole 2.54: 1(2.4,0) 2(-2.4,0)
CRYSTAL-SMD_L3.2-W1.5-1
  rect 1.05x1.7 smd: 1(-1.275,0) 2(1.275,0)
CRYSTAL-SMD_L5.0-W3.2
  rect 1.9x2.4 smd: 1(-2.05,0) 2(2.05,0)
HDR-TH_4P-P2.54-V-M
  rect 1.7x1.7 hole 1.1: 1(-3.81,0)
  round 1.7 hole 1.1: 2(-1.27,0) 3(1.27,0) 4(3.81,0)
HDR-TH_8P-P2.54-V-F-R2-C4-S2.54
  rect 1.6x1.6 hole 1.1: 1(-3.81,-1.27)
  round 1.6 hole 1.1: 2(-3.81,1.27) 3(-1.27,-1.27) 4(-1.27,1.27) 5(1.27,-1.27) 6(1.27,1.27) 7(3.81,-1.27) 8(3.81,1.27)
HDR-TH_8P-P2.54-V-M-R2-C4-S2.54
  rect 1.7x1.7 hole 1.1: 1(-3.81,-1.27)
  round 1.7 hole 1.1: 2(-3.81,1.27) 3(-1.27,-1.27) 4(-1.27,1.27) 5(1.27,-1.27) 6(1.27,1.27) 7(3.81,-1.27) 8(3.81,1.27)
KEY-SMD_L6.2-W3.6-LS8.0
  rect 1.4x1.5 smd: 1(-3.8,0) 2(3.8,0)
LED1206-R-RD_RED
  rect 1.485x1.62 smd: 1(1.492,0) 2(-1.492,0)
LQFP-48_L7.0-W7.0-P0.50-LS9.0-BL
  oval 0.27x1.5 smd: 1(-2.75,-4.25) 2(-2.25,-4.25) 3(-1.75,-4.25) 4(-1.25,-4.25) 5(-0.75,-4.25) 6(-0.25,-4.25) 7(0.25,-4.25) 8(0.75,-4.25) 9(1.25,-4.25) 10(1.75,-4.25) 11(2.25,-4.25) 12(2.75,-4.25) 25(2.75,4.25) 26(2.25,4.25) 27(1.75,4.25) 28(1.25,4.25) 29(0.75,4.25) 30(0.25,4.25) 31(-0.25,4.25) 32(-0.75,4.25) 33(-1.25,4.25) 34(-1.75,4.25) 35(-2.25,4.25) 36(-2.75,4.25)
  oval 1.5x0.27 smd: 13(4.25,-2.75) 14(4.25,-2.25) 15(4.25,-1.75) 16(4.25,-1.25) 17(4.25,-0.75) 18(4.25,-0.25) 19(4.25,0.25) 20(4.25,0.75) 21(4.25,1.25) 22(4.25,1.75) 23(4.25,2.25) 24(4.25,2.75) 37(-4.25,2.75) 38(-4.25,2.25) 39(-4.25,1.75) 40(-4.25,1.25) 41(-4.25,0.75) 42(-4.25,0.25) 43(-4.25,-0.25) 44(-4.25,-0.75) 45(-4.25,-1.25) 46(-4.25,-1.75) 47(-4.25,-2.25) 48(-4.25,-2.75)
M3螺丝
  round 3.2 hole 3.2: 1(0,0)
R0603
  rect 0.806x0.864 smd: 1(-0.753,0) 2(0.753,0)
SMB_L4.6-W3.6-LS5.3-RD
  rect 2.047x2.192 smd: 1(-2.361,0) 2(2.361,0)
SOIC-8_L4.9-W3.9-P1.27-LS6.0-BL
  oval 0.588x2.045 smd: 1(-1.905,-2.57) 2(-0.635,-2.57) 3(0.635,-2.57) 4(1.905,-2.57) 5(1.905,2.57) 6(0.635,2.57) 7(-0.635,2.57) 8(-1.905,2.57)
SOT-23-3_L2.9-W1.3-P1.90-LS2.4-TR
  rect 1.25x0.7 smd: 1(1.25,0.95) 2(1.25,-0.95) 3(-1.25,0)
SOT-223-3_L6.5-W3.4-P2.30-LS7.0-BR
  rect 2.5x1.1 smd: 1(2.97,-2.3) 2(2.97,0) 3(2.97,2.3)
  rect 2.34x3.6 smd: 4(-2.97,0)
SW-TH_SS-12D10L5
  oval 2x3 hole 1.3x2: 1(-4.7,0) 2(0,0) 3(4.7,0)
TESTPOINT-TH_BD2.0_C9900010656
  round 1.27 smd: 1(0,0)

## Nets
As in the schematic.

Pads without a net: CN26 1; H17 2 4 6 8; H28 4 6 8; SCREW1 1; SW17 3; U41 7; U59 7

## Via types
v1: diameter 0.559, hole 0.305, Top Layer to Bottom Layer, 94 vias

## Routing (per net, layer and track width the routed paths; a pad name or vN(x,y) marks a point on that pad's centre or on a via; arc(x,y) is an arc through that point)
5V_CORE: length 16.7
  Top Layer w0.381: v1(47.48,38.27) 47.48,37.47 48.61,36.34 51.78,36.34 54.07,38.63 54.07,41.48 v1(56.04,43.45)
  Bottom Layer w0.508: U57.1 58.26,43.45 v1(56.04,43.45)
  vias: v1(47.48,39.27) v1(48.48,39.27) v1(48.48,38.27) v1(49.48,39.27) v1(49.48,38.27) v1(55.64,24.17) v1(55.64,23.17) v1(56.64,24.17) v1(56.64,23.17) v1(57.64,24.17) v1(57.64,23.17)
5V_USER: length 27.3
  Top Layer w0.381: C123.2 35.03,36.85 36.56,35.33 51.91,35.33 55.97,39.39 v1(55.97,40.15)
  Bottom Layer w0.508: U60.1 v1(55.97,40.15)
  vias: v1(32.49,39.14) v1(32.49,38.14) v1(33.49,39.14) v1(33.49,38.14) v1(34.49,39.14) v1(34.49,38.14)
GND: length 11.5
  Top Layer w0.254: H27.1 34.19,27.06 34.19,24.91 ; C47.1 48.55,26.76 47.53,25.74 C56.1
  vias: v1(25.3,41.93) v1(25.3,40.93) v1(25.75,29.88) v1(26.3,41.93) v1(26.3,40.93) v1(26.44,3.96) v1(27.3,41.93) v1(27.3,40.93) v1(28.33,29.88) v1(34.32,15.77) v1(36.43,39.76) v1(36.43,37.87) v1(37.49,3.96) v1(40.42,41.93) v1(40.42,40.93) v1(41.42,41.93) v1(41.42,40.93) v1(42.42,41.93) v1(42.42,40.93) v1(44.29,14.44) v1(48.41,3.96) v1(50.49,26.86) v1(51.21,39.86) v1(51.21,38) v1(59.46,3.96) v1(65.82,46.76) v1(65.82,43.39) v1(65.82,40.02) v1(65.82,36.65) v1(75.09,33.7)
VCC3.3: length 53.6
  Top Layer w0.254: U1.9 36.71,18.77 37.05,18.44 37.05,17.1 v1(35.72,15.77)
  Top Layer w0.381: U1.36 44.29,22.85 v1(44.29,24.34) ; U1.48 36.68,24.27 36.03,24.91 v1(35.59,24.91) ; C57.2 v1(44.23,15.77) U1.24
  Top Layer w0.762: v1(52.44,25.36) C47.2 50.53,25.32 U38.4
  VCC w0.508: v1(35.72,15.77) 33.56,13.61 19.84,13.61 16.24,17.21
  Bottom Layer w0.254: v1(52.44,25.36) 52.44,33.32 v1(55.97,36.85)
  Bottom Layer w0.508: U53.1 v1(55.97,36.85)
  vias: v1(50.64,22.8) v1(50.64,21.8) v1(50.64,20.8) v1(50.64,19.8) v1(50.64,18.8) v1(50.64,17.8) v1(51.64,22.8) v1(51.64,21.8) v1(51.64,20.8) v1(51.64,19.8) v1(51.64,18.8) v1(51.64,17.8) v1(52.64,22.8) v1(52.64,21.8) v1(52.64,20.8) v1(52.64,19.8) v1(52.64,18.8) v1(52.64,17.8) v1(53.64,22.8) v1(53.64,21.8) v1(53.64,20.8) v1(53.64,19.8) v1(53.64,18.8) v1(53.64,17.8)
VCC_IN: length 22.3
  Top Layer w0.381: v1(56.1,46.76) 47.97,46.76 45.05,43.84 45.05,39.01 44.16,38.12 U41.4
  Bottom Layer w0.508: U58.1 v1(56.1,46.76)
BEEP: length 37.2
  Top Layer w0.254: v1(75.37,32.14) 75.13,31.9 51.15,31.9 46.19,26.95 43.61,26.95 42.22,25.55 U1.38
DUOJI_1: length 36.9
  Top Layer w0.254: v1(39.72,19.71) 38.72,18.71 U1.16
  Bottom Layer w0.254: CN49.3 57.62,27.96 54.19,24.53 49.24,24.53 44.42,19.71 v1(39.72,19.71)
DUOJI_2: length 66.7
  Top Layer w0.254: v1(39.72,18.44) 39.22,17.94 U1.17
  Bottom Layer w0.254: v1(39.72,18.44) 40.1,18.82 46.32,18.82 47.08,18.06 47.08,11.58 47.97,10.69 66.39,10.69 67.15,9.93 67.15,8.15 67.59,7.71 71.4,7.71 72.99,9.29 72.99,24.41 CN52.3
DUOJI_3: length 48.6
  Top Layer w0.254: v1(40.1,11.96) 39.72,12.34 U1.18
  Bottom Layer w0.254: CN50.3 73.75,13.1 73.75,9.04 71.85,7.13 64.48,7.13 61.43,10.18 41.88,10.18 v1(40.1,11.96)
I2C1_SCL: length 5.2
  Top Layer w0.254: v1(41.24,26.57) 40.22,25.55 40.22,24.28 U1.42
  Bottom Layer w0.254: v1(41.24,26.57) 41.24,29.02 H27.3
I2C1_SDA: length 7.4
  Top Layer w0.254: H27.4 42.21,27.45 40.48,27.45 39.72,26.69 39.72,24.27
KEY1: length 8.9
  Top Layer w0.254: SW11.2 38.95,7.44 38.95,11.2 37.72,12.44 U1.14
KEY2: length 16.9
  Top Layer w0.254: U1.15 38.22,12.83 42.13,8.91 48.38,8.91 SW12.2
KEY3: length 26.1
  Top Layer w0.254: U1.21 41.22,10.72 42.38,9.55 58.76,9.55 SW13.2
LED1: length 19.5
  Top Layer w0.254: U40.1 51.65,33.42 45.81,27.58 43.4,27.58 41.72,25.9 U1.39
OSCIN: length 13
  Top Layer w0.254: U1.5 28.64,20.77 X3.1 26.36,23.05 C64.1
OSCOUT: length 13.1
  Top Layer w0.254: U1.6 34.62,20.27 34.61,20.27 28.74,20.27 X3.2 26.33,17.86 C65.1
PA2: length 40.8
  Top Layer w0.254: U1.12 31.31,17.27 28.54,14.5 10.25,14.5 7.84,16.91 7.84,22.37 6.7,23.52 4.79,23.52 3.7,24.61 H17.1
PA3: length 44.2
  Top Layer w0.254: 3.7,22.29 2.93,22.29 2.38,21.74 2.38,16.53 5.22,13.69 36.11,13.69 37.22,14.79 U1.13
PA9: length 32.1
  Top Layer w0.254: CN26.2 68.65,11.2 48.86,11.2 47.72,12.34 47.72,18.31 46.26,19.77 U1.30
PA10: length 32.7
  Top Layer w0.254: CN26.3 66.79,11.83 49.11,11.83 48.23,12.72 48.23,18.56 46.52,20.27 U1.31
PA13: length 28.8
  Top Layer w0.254: U1.34 42.8,21.77 v1(42.38,21.36)
  Bottom Layer w0.254: v1(42.38,21.36) 30.7,21.36 29.09,19.75 H28.3
PA14: length 28.1
  Top Layer w0.254: U1.37 42.72,22.83 v1(42.38,22.5)
  Bottom Layer w0.254: v1(42.38,22.5) 42.17,22.29 16.24,22.29
PC14: length 14.4
  Top Layer w0.254: U1.3 32.83,21.77 32.34,22.27 arc(32.23,22.54) 32.34,22.8 32.37,22.83 arc(32.37,23.37) 31.83,23.37 31.8,23.34 arc(31.26,23.34) 31.26,23.88 31.29,23.91 arc(31.29,24.45) 30.75,24.45 30.72,24.42 arc(30.18,24.42) 30.18,24.96 30.21,24.99 arc(30.21,25.53) 29.67,25.53 29.64,25.5 arc(29.37,25.39) 29.1,25.5 X2.1 28.29,28.5 C68.1
PC15: length 14.3
  Top Layer w0.254: U1.4 30.79,21.27 25.75,26.31 X2.2 25.74,28.53 C69.1
RESET: length 39.4
  Top Layer w0.254: U1.7 30.38,19.77 v1(29.68,19.07)
  Bottom Layer w0.254: 13.7,17.21 13.7,13.09 17.87,8.91 26.37,8.91 v1(27.9,7.39) 27.9,17.28 v1(29.68,19.07)
$1N2481: length 5.5
  Top Layer w0.508: U41.8 47.54,42.26 48.48,43.2 50.38,43.2 51.21,42.38 R21.1
$1N3606:
  vias: v1(60.03,36.82)
$1N4411:
  vias: v1(60.03,43.45)
$1N4573:
  vias: v1(60.03,46.77)
$1N5391: length 5.3
  Top Layer w0.508: U59.8 33.56,42.95 35.65,42.95 36.43,42.17 R22.1
$1N5413:
  vias: v1(60.03,40.14)

## Copper pours and planes (outline as drawn; the poured copper is in the pictures)
5V_CORE on Top Layer: 53.69,26.07 58.05,26.07 58.05,21.99 55.03,21.99 55.03,24.24 53.72,24.24 53.69,24.28 53.69,26.07
5V_CORE on Top Layer: 46.49,40.02 46.49,37.05 50.51,37.05 50.51,42.29 48.88,42.29 48.86,42.31 48.86,40.03 48.85,40.02
5V_CORE on VCC: 46.49,40.2 46.49,29.49 55.08,29.49 55.08,21.99 58.1,21.99 58.1,34.57 50.64,34.57 50.64,40.26 46.55,40.26
5V_USER on Top Layer: 31.49,40.02 31.49,37.11 35.73,37.11 35.73,42.3 34,42.3 34,40.03 34,40.02
5V_USER on VCC: -1.18,51.71 80.48,51.71 80.48,-5.18 -1.18,-5.18
GND on Top Layer: 49.62,27.58 57.07,27.58 57.07,26.35 49.62,26.35
GND on Top Layer: 50.79,40.57 52.16,40.57 52.16,37.36 50.79,37.36
GND on Top Layer: 36.01,40.47 37.12,40.47 37.12,37.25 36.01,37.25
GND on Top Layer: 39.34,42.69 43.44,42.69 43.44,40.02 39.34,40.02
GND on Top Layer: 62.32,47.9 66.77,47.9 66.77,32.66 62.32,32.66
GND on Top Layer: 24.22,42.69 28.44,42.69 28.44,40.2 24.22,40.2
GND on Top Layer: -3.59,50.7 85.69,50.7 85.69,-6.45 -3.59,-6.45
GND on GND: -2.45,50.82 83.53,50.82 83.53,-5.31 -2.45,-5.31
VCC3.3 on Top Layer: 54.7,24.03 54.83,23.9 54.83,21.63 58.02,21.63 58.02,19.58 54.87,19.58 54.87,16.77 52.82,16.77 52.8,16.79 52.8,13 49.13,13 49.11,12.98 49.11,24.03
VCC3.3 on VCC: 33.11,26.06 59.13,26.06 59.13,13 33.11,13
VCC_IN on Top Layer: 6.52,36.6 23.46,36.6 23.46,32.97 45.56,32.97 45.56,50.31 12.79,50.31 12.79,42.57 12.49,42.57
VIN on Top Layer: -0.08,50.06 -0.08,36.47 6.44,36.47 12.79,42.82 12.79,50.06 12.79,50.06
KEY1 on Top Layer: 38.2,8.37 39.84,8.37 39.84,3.07 38.2,3.07
KEY2 on Top Layer: 49.24,8.15 50.89,8.15 50.89,3.2 49.24,3.2
KEY3 on Top Layer: 60.22,8.16 61.69,8.16 61.69,3.07 60.22,3.07
RESET on Top Layer: 27.2,8.37 28.79,8.37 28.79,3.07 27.2,3.07
$1N1503 on Top Layer: 57.62,34.57 60.83,34.57 60.83,32.4 57.62,32.4
$1N1618 on Bottom Layer: 74.9,39.14 77.17,39.14 77.17,35.6 74.9,35.6
$1N1623 on Bottom Layer: 76.2,34.46 77.5,34.46 77.5,31.52 76.2,31.52
$1N3606 on Bottom Layer: 59.06,37.86 61.05,37.86 61.05,35.71 59.06,35.71
$1N4411 on Bottom Layer: 59.06,44.49 61.05,44.49 61.05,42.44 59.06,42.44
$1N4573 on Bottom Layer: 59.06,47.81 60.96,47.81 60.96,45.73 59.06,45.73
$1N5413 on Bottom Layer: 59.06,41.18 60.98,41.18 60.98,39.1 59.06,39.1

## Text on the board
Top Silkscreen Layer: + | - | TX2 | 5V | 2200340117贺伟杰 / 2026年3月20日 | RST | GND | CLK | DIO | 3.3 | KEY1 | G | SCL | SDA | KEY2 | 芯片3.3V | KEY3 | RX1 | TX1 | D1 | 可控LED | 5VU | 5VC | VIN | D3 | D2 | <-开 | 外设5V | 芯片5V
